# EasyEDA schematic design.json
TITLE: REV 0; REV: 1.0; Date: 2023-02-18; Sheet: 1/1; Drawn By: iamapythongeek; Company: Your Company
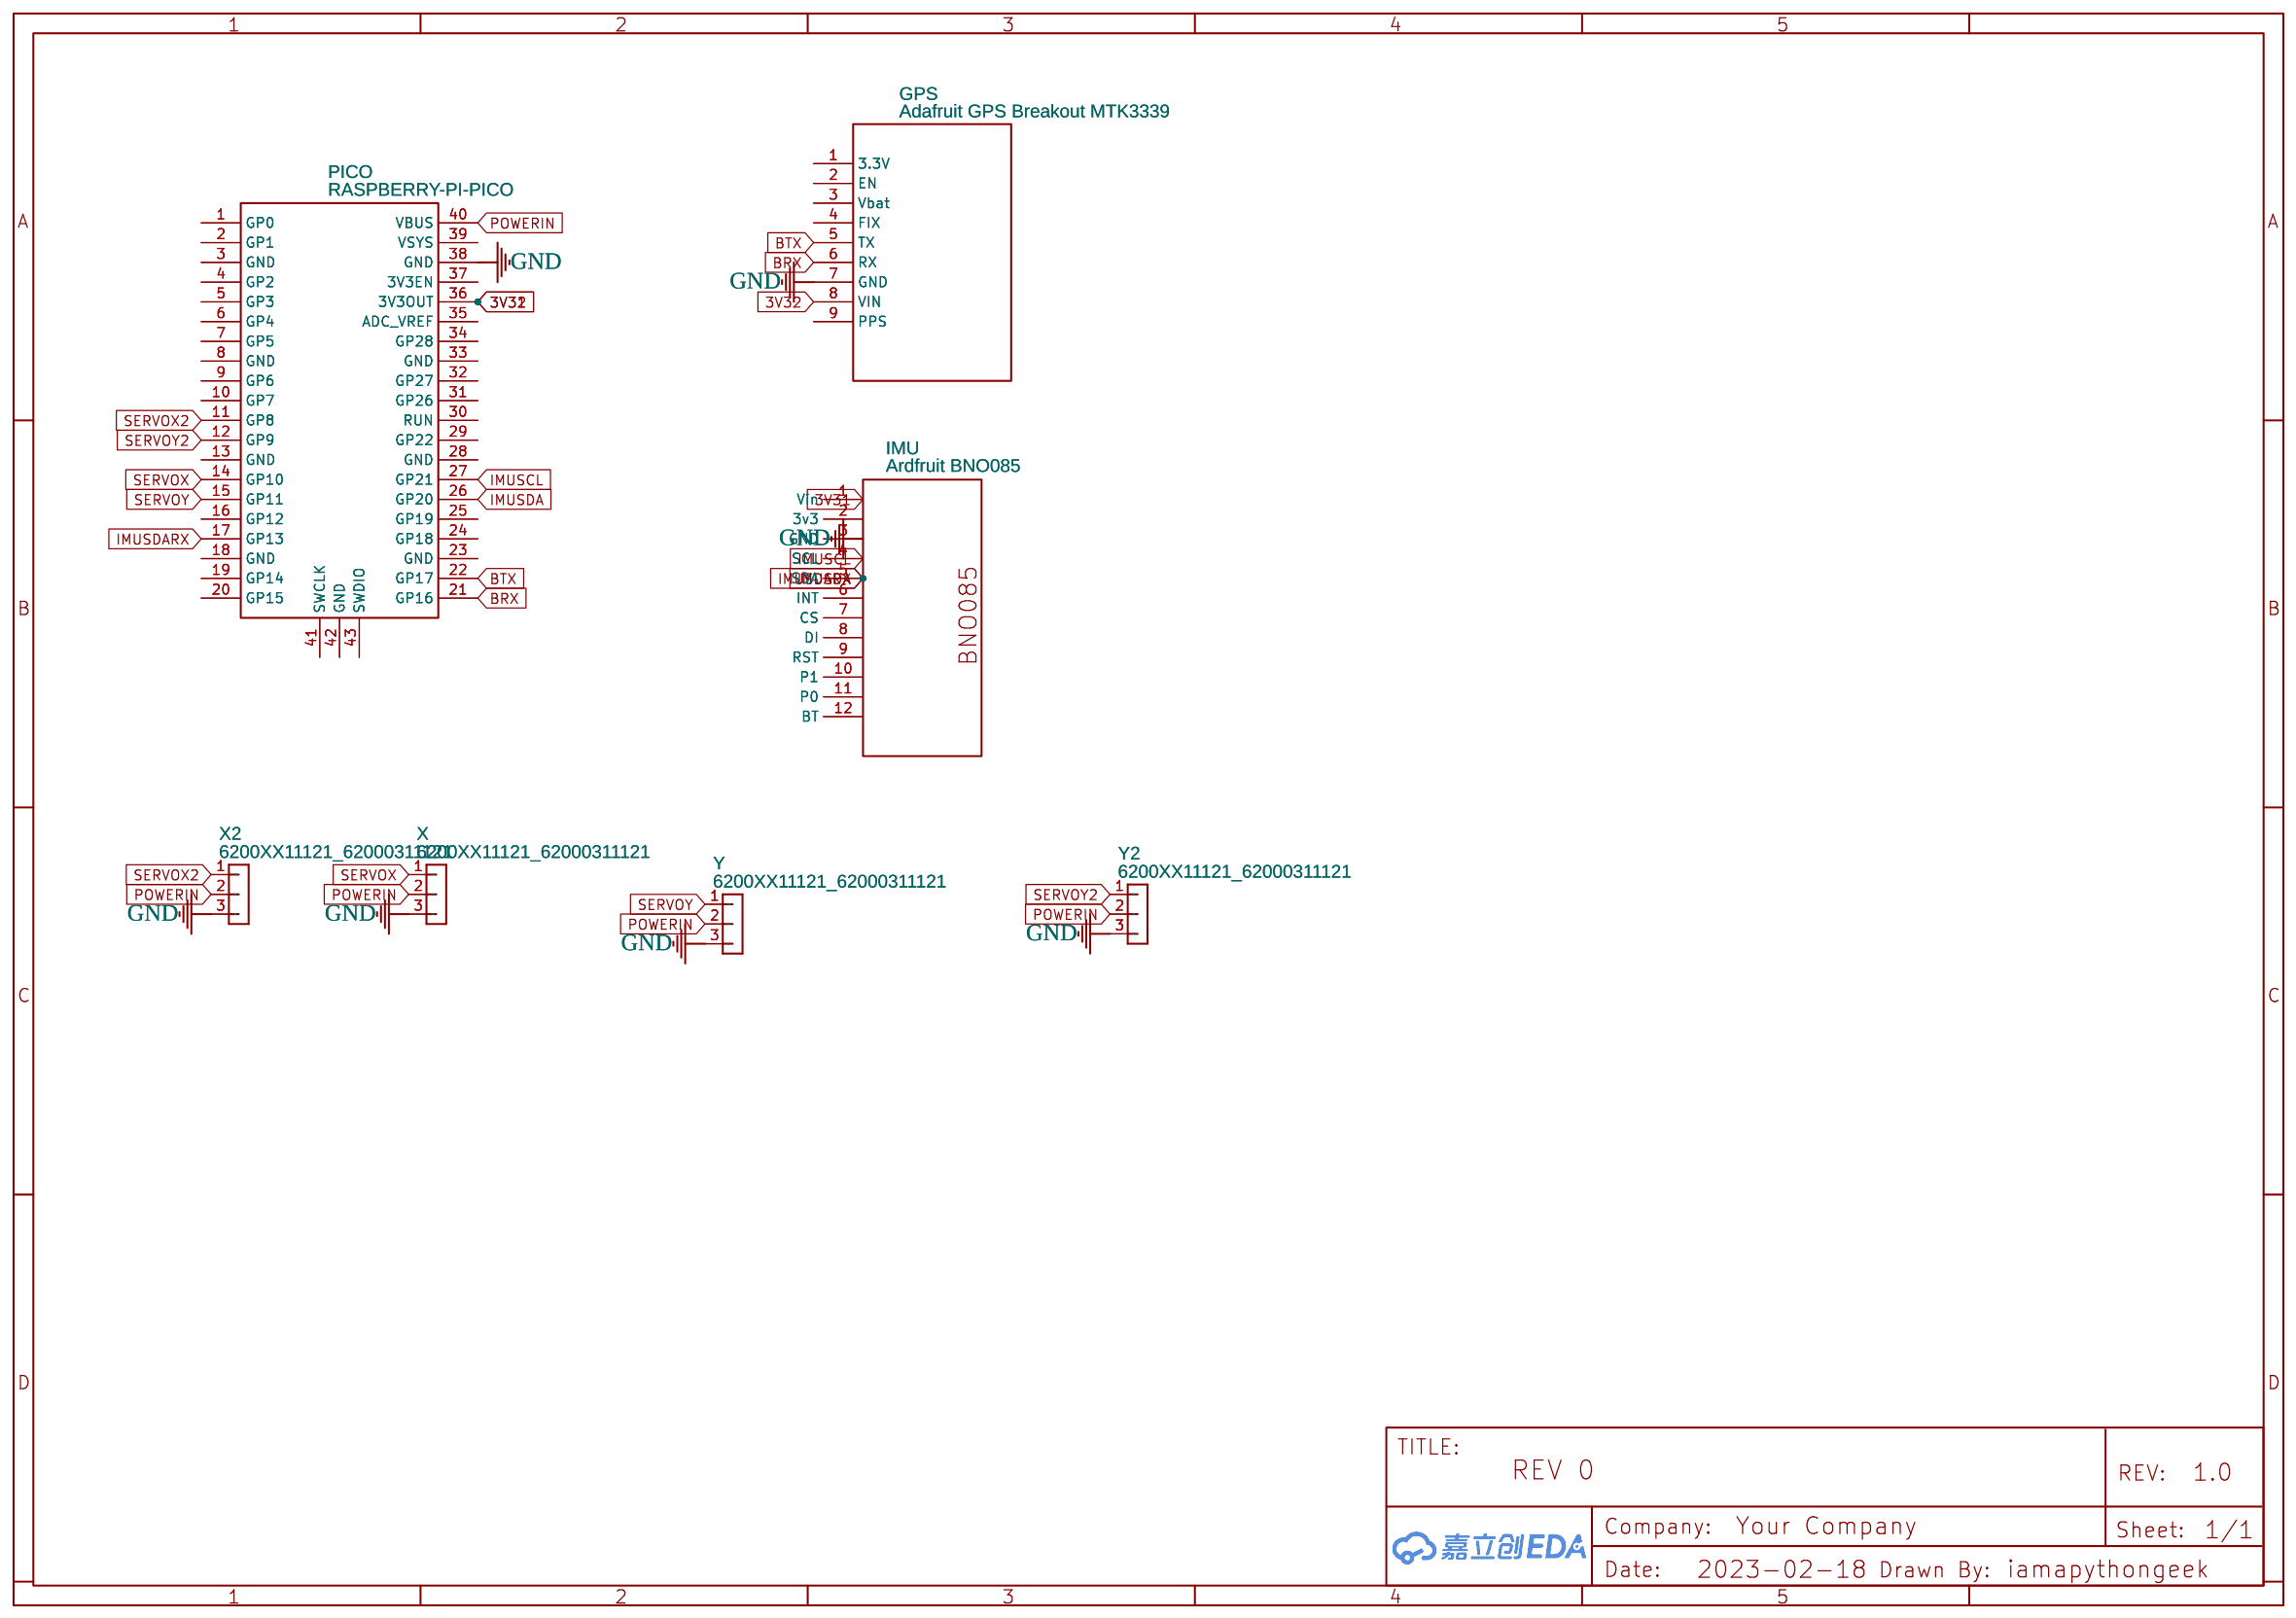
[diagram p0: schematic sheet]

## Parts
GPS  Adafruit GPS Breakout MTK3339  [ADAFRUIT - MTK3339]
IMU  Ardfruit BNO085  [ADAFRUIT-BNO085]
PICO  RASPBERRY-PI-PICO  [RASPBERRY-PI-PICO]
X  6200XX11121_62000311121  [62000311121]
X2  6200XX11121_62000311121  [62000311121]
Y  6200XX11121_62000311121  [62000311121]
Y2  6200XX11121_62000311121  [62000311121]

## Library data of the parts
GPS = Adafruit GPS Breakout MTK3339: sourceId: 1T5FDZYC8
IMU = Ardfruit BNO085: Manufacturer: Ardfruit; Contributor: Peter Armstrong
PICO = RASPBERRY-PI-PICO: Contributor: kazhida
X X2 Y Y2 = 6200XX11121_62000311121: Contributor: talhaguleryuz

## Nets
3V31: GPS.8(VIN) IMU.1(Vin) PICO.36(3V3OUT)
GND: GPS.7(GND) IMU.3(GND) PICO.38(GND) X.3 X2.3 Y.3 Y2.3
BRX: GPS.6(RX) PICO.21(GP16)
BTX: GPS.5(TX) PICO.22(GP17)
IMUSCL: IMU.4(SCL) PICO.27(GP21)
IMUSDA: IMU.5(SDA) PICO.17(GP13) PICO.26(GP20)
POWERIN: PICO.40(VBUS) X.2 X2.2 Y.2 Y2.2
SERVOX: PICO.14(GP10) X.1
SERVOX2: PICO.11(GP8) X2.1
SERVOY: PICO.15(GP11) Y.1
SERVOY2: PICO.12(GP9) Y2.1

Not connected (* = marked no-connect by the designer): GPS 1(3.3V) 2(EN) 3(Vbat) 4(FIX) 9(PPS); IMU 2(3v3) 6(INT) 7(CS) 8(DI) 9(RST) 10(P1) 11(P0) 12(BT); PICO 1(GP0) 2(GP1) 3(GND) 4(GP2) 5(GP3) 6(GP4) 7(GP5) 8(GND) 9(GP6) 10(GP7) 13(GND) 16(GP12) 18(GND) 19(GP14) 20(GP15) 23(GND) 24(GP18) 25(GP19) 28(GND) 29(GP22) 30(RUN) 31(GP26) 32(GP27) 33(GND) 34(GP28) 35(ADC_VREF) 37(3V3EN) 39(VSYS) 41(SWCLK) 42(GND) 43(SWDIO)
